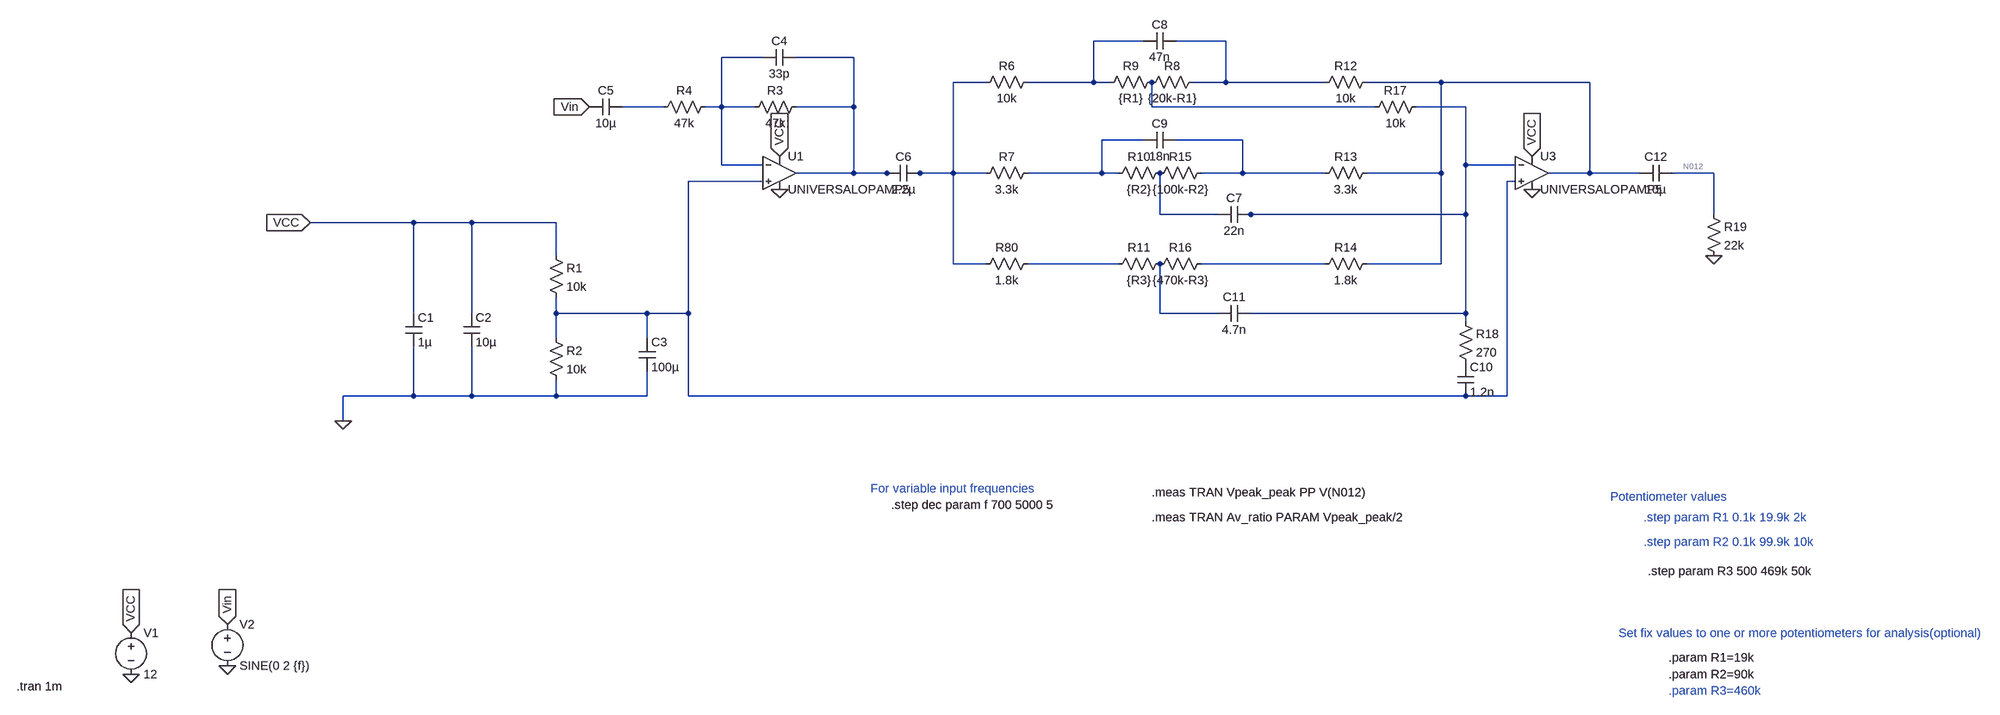
[diagram p0: schematic equalizer.asc]
equalizer.asc, the LTspice schematic file:
Version 4.1
SHEET 1 3728 968
WIRE 2032 -416 1936 -416
WIRE 2192 -416 2096 -416
WIRE 1296 -384 1216 -384
WIRE 1472 -384 1360 -384
WIRE 1728 -336 1664 -336
WIRE 1936 -336 1936 -416
WIRE 1936 -336 1808 -336
WIRE 1968 -336 1936 -336
WIRE 2192 -336 2192 -416
WIRE 2192 -336 2128 -336
WIRE 2384 -336 2192 -336
WIRE 2608 -336 2464 -336
WIRE 2896 -336 2608 -336
WIRE 1104 -288 1024 -288
WIRE 1216 -288 1216 -384
WIRE 1216 -288 1184 -288
WIRE 1280 -288 1216 -288
WIRE 1472 -288 1472 -384
WIRE 1472 -288 1360 -288
WIRE 2048 -288 2048 -336
WIRE 2480 -288 2048 -288
WIRE 2656 -288 2560 -288
WIRE 2032 -224 1952 -224
WIRE 2224 -224 2096 -224
WIRE 1216 -176 1216 -288
WIRE 1296 -176 1216 -176
WIRE 2656 -176 2656 -288
WIRE 2752 -176 2656 -176
WIRE 1472 -160 1472 -288
WIRE 1472 -160 1360 -160
WIRE 1536 -160 1472 -160
WIRE 1552 -160 1536 -160
WIRE 1600 -160 1584 -160
WIRE 1664 -160 1664 -336
WIRE 1664 -160 1600 -160
WIRE 1728 -160 1664 -160
WIRE 1952 -160 1952 -224
WIRE 1952 -160 1808 -160
WIRE 1984 -160 1952 -160
WIRE 2224 -160 2224 -224
WIRE 2224 -160 2144 -160
WIRE 2384 -160 2224 -160
WIRE 2608 -160 2608 -336
WIRE 2608 -160 2464 -160
WIRE 2896 -160 2896 -336
WIRE 2896 -160 2816 -160
WIRE 2992 -160 2896 -160
WIRE 3136 -160 3056 -160
WIRE 1296 -144 1152 -144
WIRE 2752 -144 2736 -144
WIRE 2064 -80 2064 -160
WIRE 2176 -80 2064 -80
WIRE 2240 -80 2224 -80
WIRE 2656 -80 2656 -176
WIRE 2656 -80 2240 -80
WIRE 3136 -80 3136 -160
WIRE 592 -64 368 -64
WIRE 704 -64 592 -64
WIRE 896 -64 704 -64
WIRE 896 0 896 -64
WIRE 1664 16 1664 -160
WIRE 1728 16 1664 16
WIRE 1984 16 1808 16
WIRE 2384 16 2144 16
WIRE 2608 16 2608 -160
WIRE 2608 16 2464 16
WIRE 592 112 592 -64
WIRE 704 112 704 -64
WIRE 896 112 896 80
WIRE 1072 112 896 112
WIRE 1152 112 1152 -144
WIRE 1152 112 1072 112
WIRE 2064 112 2064 16
WIRE 2176 112 2064 112
WIRE 2656 112 2656 -80
WIRE 2656 112 2240 112
WIRE 2656 128 2656 112
WIRE 896 160 896 112
WIRE 1072 160 1072 112
WIRE 592 272 592 176
WIRE 592 272 432 272
WIRE 704 272 704 176
WIRE 704 272 592 272
WIRE 896 272 896 240
WIRE 896 272 704 272
WIRE 1072 272 1072 224
WIRE 1072 272 896 272
WIRE 1152 272 1152 112
WIRE 2656 272 1152 272
WIRE 2736 272 2736 -144
WIRE 2736 272 2656 272
WIRE 432 320 432 272
FLAG 432 320 0
FLAG -80 864 0
FLAG -80 784 VCC
IOPIN -80 784 In
FLAG 368 -64 VCC
IOPIN 368 -64 In
FLAG 1328 -128 0
FLAG 1328 -192 VCC
IOPIN 1328 -192 In
FLAG 208 848 0
FLAG 208 768 Vin
IOPIN 208 768 In
FLAG 960 -288 Vin
IOPIN 960 -288 In
FLAG 2784 -128 0
FLAG 2784 -192 VCC
IOPIN 2784 -192 In
FLAG 3136 0 0
SYMBOL cap 576 112 R0
SYMATTR InstName C1
SYMATTR Value 1µ
SYMBOL cap 688 112 R0
SYMATTR InstName C2
SYMATTR Value 10µ
SYMBOL res 880 -16 R0
SYMATTR InstName R1
SYMATTR Value 10k
SYMBOL res 880 144 R0
SYMATTR InstName R2
SYMATTR Value 10k
SYMBOL cap 1056 160 R0
SYMATTR InstName C3
SYMATTR Value 100µ
SYMBOL voltage -80 768 R0
WINDOW 123 0 0 Left 0
WINDOW 39 0 0 Left 0
SYMATTR InstName V1
SYMATTR Value 12
SYMBOL cap 1360 -400 R90
WINDOW 0 0 32 VBottom 2
WINDOW 3 32 32 VTop 2
SYMATTR InstName C4
SYMATTR Value 33p
SYMBOL res 1376 -304 R90
WINDOW 0 0 56 VBottom 2
WINDOW 3 32 56 VTop 2
SYMATTR InstName R3
SYMATTR Value 47k
SYMBOL res 1200 -304 R90
WINDOW 0 0 56 VBottom 2
WINDOW 3 32 56 VTop 2
SYMATTR InstName R4
SYMATTR Value 47k
SYMBOL cap 1024 -304 R90
WINDOW 0 0 32 VBottom 2
WINDOW 3 32 32 VTop 2
SYMATTR InstName C5
SYMATTR Value 10µ
SYMBOL cap 1600 -176 R90
WINDOW 0 0 32 VBottom 2
WINDOW 3 32 32 VTop 2
SYMATTR InstName C6
SYMATTR Value 2.2µ
SYMBOL voltage 208 752 R0
WINDOW 123 0 0 Left 0
WINDOW 39 0 0 Left 0
SYMATTR InstName V2
SYMATTR Value SINE(0 2 {f})
SYMBOL res 1824 -352 R90
WINDOW 0 0 56 VBottom 2
WINDOW 3 32 56 VTop 2
SYMATTR InstName R6
SYMATTR Value 10k
SYMBOL res 1824 -176 R90
WINDOW 0 0 56 VBottom 2
WINDOW 3 32 56 VTop 2
SYMATTR InstName R7
SYMATTR Value 3.3k
SYMBOL res 1824 0 R90
WINDOW 0 0 56 VBottom 2
WINDOW 3 32 56 VTop 2
SYMATTR InstName R80
SYMATTR Value 1.8k
SYMBOL res 2064 -352 R90
WINDOW 0 0 56 VBottom 2
WINDOW 3 32 56 VTop 2
SYMATTR InstName R9
SYMATTR Value {R1}
SYMBOL cap 2096 -432 R90
WINDOW 0 0 32 VBottom 2
WINDOW 3 32 32 VTop 2
SYMATTR InstName C8
SYMATTR Value 47n
SYMBOL cap 2096 -240 R90
WINDOW 0 0 32 VBottom 2
WINDOW 3 32 32 VTop 2
SYMATTR InstName C9
SYMATTR Value 18n
SYMBOL res 2080 -176 R90
WINDOW 0 0 56 VBottom 2
WINDOW 3 32 56 VTop 2
SYMATTR InstName R10
SYMATTR Value {R2}
SYMBOL res 2080 0 R90
WINDOW 0 0 56 VBottom 2
WINDOW 3 32 56 VTop 2
SYMATTR InstName R11
SYMATTR Value {R3}
SYMBOL res 2480 -352 R90
WINDOW 0 0 56 VBottom 2
WINDOW 3 32 56 VTop 2
SYMATTR InstName R12
SYMATTR Value 10k
SYMBOL res 2480 -176 R90
WINDOW 0 0 56 VBottom 2
WINDOW 3 32 56 VTop 2
SYMATTR InstName R13
SYMATTR Value 3.3k
SYMBOL res 2480 0 R90
WINDOW 0 0 56 VBottom 2
WINDOW 3 32 56 VTop 2
SYMATTR InstName R14
SYMATTR Value 1.8k
SYMBOL res 2144 -352 R90
WINDOW 0 0 56 VBottom 2
WINDOW 3 32 56 VTop 2
SYMATTR InstName R8
SYMATTR Value {20k-R1}
SYMBOL res 2160 -176 R90
WINDOW 0 0 56 VBottom 2
WINDOW 3 32 56 VTop 2
SYMATTR InstName R15
SYMATTR Value {100k-R2}
SYMBOL res 2160 0 R90
WINDOW 0 0 56 VBottom 2
WINDOW 3 32 56 VTop 2
SYMATTR InstName R16
SYMATTR Value {470k-R3}
SYMBOL res 2576 -304 R90
WINDOW 0 0 56 VBottom 2
WINDOW 3 32 56 VTop 2
SYMATTR InstName R17
SYMATTR Value 10k
SYMBOL res 2640 112 R0
SYMATTR InstName R18
SYMATTR Value 270
SYMBOL cap 2640 208 R0
SYMATTR InstName C10
SYMATTR Value 1.2n
SYMBOL cap 2240 -96 R90
WINDOW 0 0 32 VBottom 2
WINDOW 3 32 32 VTop 2
SYMATTR InstName C7
SYMATTR Value 22n
SYMBOL cap 2240 96 R90
WINDOW 0 0 32 VBottom 2
WINDOW 3 32 32 VTop 2
SYMATTR InstName C11
SYMATTR Value 4.7n
SYMBOL cap 3056 -176 R90
WINDOW 0 0 32 VBottom 2
WINDOW 3 32 32 VTop 2
SYMATTR InstName C12
SYMATTR Value 10µ
SYMBOL res 3120 -96 R0
SYMATTR InstName R19
SYMATTR Value 22k
SYMBOL OpAmps\\UniversalOpAmp5 2784 -160 R0
SYMATTR InstName U3
SYMBOL OpAmps\\UniversalOpAmp5 1328 -160 R0
SYMATTR InstName U1
TEXT -320 888 Left 2 !.tran 1m
TEXT 3000 560 Left 2 ;.step param R1 0.1k 19.9k 2k
TEXT 3000 608 Left 2 ;.step param R2 0.1k 99.9k 10k
TEXT 3008 664 Left 2 !.step param R3 500 469k 50k
TEXT 1544 536 Left 2 !.step dec param f 700 5000 5
TEXT 2048 512 Left 2 !.meas TRAN Vpeak_peak PP V(N012)
TEXT 3048 832 Left 2 !.param R1=19k
TEXT 3048 864 Left 2 !.param R2=90k
TEXT 3048 896 Left 2 ;.param R3=460k
TEXT 2048 560 Left 2 !.meas TRAN Av_ratio PARAM Vpeak_peak/2
TEXT 1504 504 Left 2 ;For variable input frequencies
TEXT 2936 520 Left 2 ;Potentiometer values
TEXT 2952 784 Left 2 ;Set fix values to one or more potentiometers for analysis(optional)

The netlist it stands for:
* equalizer.asc
C1 VCC 0 1µ
C2 VCC 0 10µ
R1 VCC N013 10k
R2 N013 0 10k
C3 N013 0 100µ
V1 VCC 0 12
C4 N004 N003 33p
R3 N004 N003 47k
R4 N003 N007 47k
C5 N007 Vin 10µ
C6 N005 N004 2.2µ
V2 Vin 0 SINE(0 2 {f})
R6 N001 N005 10k
R7 N010 N005 3.3k
R80 N015 N005 1.8k
R9 N008 N001 {R1}
C8 N002 N001 47n
C9 N011 N010 18n
R10 N014 N010 {R2}
R11 N017 N015 {R3}
R12 N006 N002 10k
R13 N006 N011 3.3k
R14 N006 N016 1.8k
R8 N002 N008 {20k-R1}
R15 N011 N014 {100k-R2}
R16 N016 N017 {470k-R3}
R17 N009 N008 10k
R18 N009 P001 270
C10 P001 N013 1.2n
C7 N009 N014 22n
C11 N009 N017 4.7n
C12 N012 N006 10µ
R19 N012 0 22k
X§U3 N013 N009 VCC 0 N006 level5 Avol=1Meg GBW=10Meg Phimargin=45 SlewPos=10Meg SlewNeg=10Meg En=0 Enk=0 In=0 Ink=0 Rcm=500Meg Ccm=1p Rdiff=500k Cdiff=2p Ro=1k Vos=0 Ibp=2n Ibn=1n Iq=1m Rail=0 Ilimit=25m  ; UNIVERSALOPAMP5, pins In+ In- V+ V- OUT
X§U1 N013 N003 VCC 0 N004 level5 Avol=1Meg GBW=10Meg Phimargin=45 SlewPos=10Meg SlewNeg=10Meg En=0 Enk=0 In=0 Ink=0 Rcm=500Meg Ccm=1p Rdiff=500k Cdiff=2p Ro=1k Vos=0 Ibp=2n Ibn=1n Iq=1m Rail=0 Ilimit=25m  ; UNIVERSALOPAMP5, pins In+ In- V+ V- OUT
.tran 1m
* .step param R1 0.1k 19.9k 2k
* .step param R2 0.1k 99.9k 10k
.step param R3 500 469k 50k
.step dec param f 700 5000 5
.meas TRAN Vpeak_peak PP V(N012)
.param R1=19k
.param R2=90k
* .param R3=460k
.meas TRAN Av_ratio PARAM Vpeak_peak/2
* For variable input frequencies
* Potentiometer values
* Set fix values to one or more potentiometers for analysis(optional)
.backanno
.end